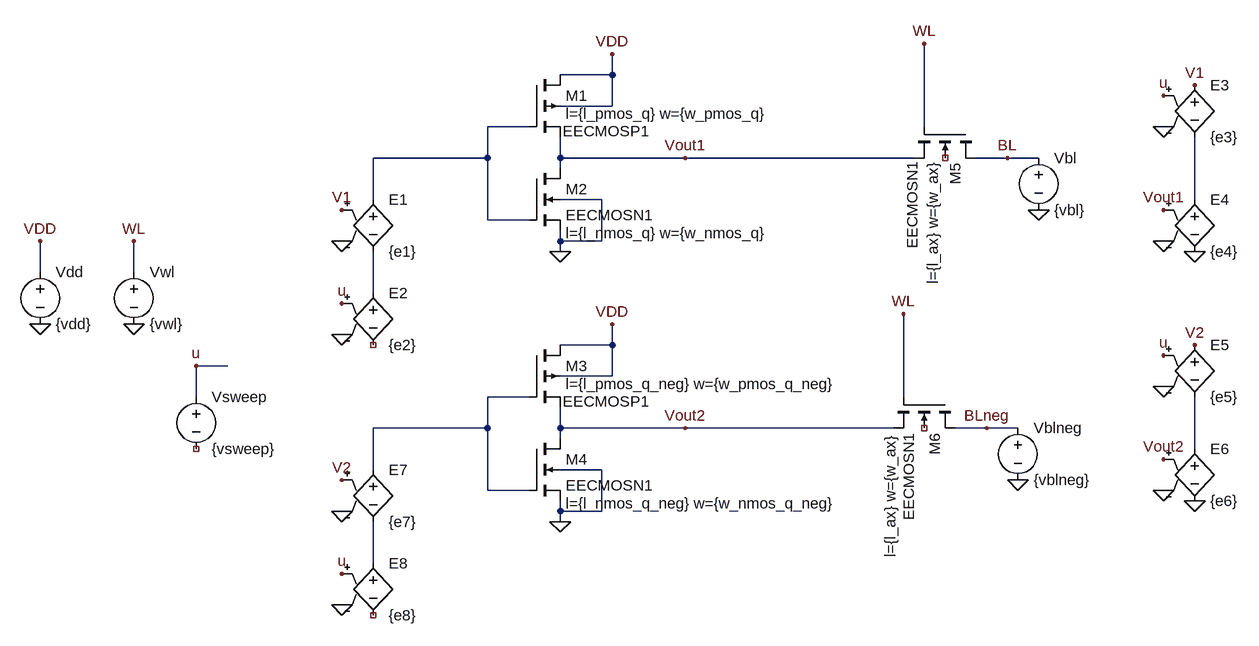
[diagram p0: schematic gaussian_vth_hold.asc]
gaussian_vth_hold.asc, the LTspice schematic file:
Version 4
SHEET 1 2120 768
WIRE 576 -160 576 -192
WIRE 576 -160 496 -160
WIRE 576 -112 576 -160
WIRE 576 -112 496 -112
WIRE 448 -80 384 -80
WIRE 1056 -80 1056 -208
WIRE 384 -32 384 -80
WIRE 384 -32 208 -32
WIRE 496 -32 496 -64
WIRE 688 -32 496 -32
WIRE 1040 -32 688 -32
WIRE 1184 -32 1136 -32
WIRE 1232 -32 1184 -32
WIRE 496 -16 496 -32
WIRE 208 32 208 -32
WIRE 560 32 496 32
WIRE 1472 32 1472 -64
WIRE 384 64 384 -32
WIRE 448 64 384 64
WIRE 496 96 496 80
WIRE 560 96 560 32
WIRE 560 96 496 96
WIRE 496 112 496 96
WIRE -304 144 -304 96
WIRE -160 144 -160 96
WIRE 208 176 208 112
WIRE 576 256 576 224
WIRE 576 256 496 256
WIRE -16 288 -64 288
WIRE 576 304 576 256
WIRE 576 304 496 304
WIRE -64 336 -64 288
WIRE 448 336 384 336
WIRE 1024 336 1024 208
WIRE 384 384 384 336
WIRE 384 384 208 384
WIRE 496 384 496 352
WIRE 688 384 496 384
WIRE 1008 384 688 384
WIRE 1152 384 1104 384
WIRE 1200 384 1152 384
WIRE 496 400 496 384
WIRE 1472 416 1472 336
WIRE 208 448 208 384
WIRE 560 448 496 448
WIRE 384 480 384 384
WIRE 448 480 384 480
WIRE 496 512 496 496
WIRE 560 512 560 448
WIRE 560 512 496 512
WIRE 496 528 496 512
WIRE 208 592 208 528
FLAG -64 288 u
FLAG 160 96 0
FLAG 160 240 0
FLAG 160 192 u
FLAG 160 48 V1
FLAG 496 112 0
FLAG 688 -32 Vout1
FLAG 1472 112 0
FLAG 1424 96 0
FLAG 1424 -80 0
FLAG 1424 -128 u
FLAG 1424 48 Vout1
FLAG 1472 -144 V1
FLAG 1424 320 0
FLAG 1472 496 0
FLAG 1424 480 0
FLAG 1424 272 u
FLAG 1472 256 V2
FLAG 1424 432 Vout2
FLAG 160 512 0
FLAG 160 656 0
FLAG 160 608 u
FLAG 160 464 V2
FLAG 496 528 0
FLAG -304 224 0
FLAG 688 384 Vout2
FLAG 1184 -32 BL
FLAG 1152 384 BLneg
FLAG -160 224 0
FLAG 1232 48 0
FLAG 1200 464 0
FLAG -304 96 VDD
FLAG 576 -192 VDD
FLAG 576 224 VDD
FLAG 1056 -208 WL
FLAG -160 96 WL
FLAG 1024 208 WL
SYMBOL voltage -64 320 R0
WINDOW 123 0 0 Left 0
WINDOW 39 0 0 Left 0
SYMATTR InstName Vsweep
SYMATTR Value {vsweep}
SYMBOL e 208 16 R0
SYMATTR InstName E1
SYMATTR Value {e1}
SYMBOL e 208 160 R0
SYMATTR InstName E2
SYMATTR Value {e2}
SYMBOL pmos4 448 -160 R0
WINDOW 3 52 87 Left 2
WINDOW 123 56 60 Left 2
SYMATTR Value EECMOSP1
SYMATTR Value2 l={l_pmos_q} w={w_pmos_q}
SYMATTR InstName M1
SYMBOL nmos4 448 -16 R0
WINDOW 123 56 100 Left 2
SYMATTR Value2 l={l_nmos_q} w={w_nmos_q}
SYMATTR InstName M2
SYMATTR Value EECMOSN1
SYMBOL e 1472 -160 R0
SYMATTR InstName E3
SYMATTR Value {e3}
SYMBOL e 1472 16 R0
SYMATTR InstName E4
SYMATTR Value {e4}
SYMBOL e 1472 240 R0
SYMATTR InstName E5
SYMATTR Value {e5}
SYMBOL e 1472 400 R0
SYMATTR InstName E6
SYMATTR Value {e6}
SYMBOL e 208 432 R0
SYMATTR InstName E7
SYMATTR Value {e7}
SYMBOL e 208 576 R0
SYMATTR InstName E8
SYMATTR Value {e8}
SYMBOL pmos4 448 256 R0
WINDOW 3 52 87 Left 2
WINDOW 123 56 60 Left 2
SYMATTR Value EECMOSP1
SYMATTR Value2 l={l_pmos_q_neg} w={w_pmos_q_neg}
SYMATTR InstName M3
SYMBOL nmos4 448 400 R0
WINDOW 123 56 100 Left 2
SYMATTR Value2 l={l_nmos_q_neg} w={w_nmos_q_neg}
SYMATTR InstName M4
SYMATTR Value EECMOSN1
SYMBOL voltage -304 128 R0
WINDOW 123 0 0 Left 0
WINDOW 39 0 0 Left 0
SYMATTR InstName Vdd
SYMATTR Value {vdd}
SYMBOL nmos4 1136 -80 R90
WINDOW 123 51 67 Left 2
WINDOW 3 54 98 Left 2
SYMATTR Value2 l={l_ax} w={w_ax}
SYMATTR Value EECMOSN1
SYMATTR InstName M5
SYMBOL voltage -160 128 R0
SYMATTR InstName Vwl
SYMATTR Value {vwl}
SYMBOL voltage 1232 -48 R0
WINDOW 123 0 0 Left 0
WINDOW 39 0 0 Left 0
SYMATTR InstName Vbl
SYMATTR Value {vbl}
SYMBOL nmos4 1104 336 R90
WINDOW 123 56 100 Left 2
SYMATTR Value2 l={l_ax} w={w_ax}
SYMATTR InstName M6
SYMATTR Value EECMOSN1
SYMBOL voltage 1200 368 R0
WINDOW 123 0 0 Left 0
WINDOW 39 0 0 Left 0
SYMATTR InstName Vblneg
SYMATTR Value {vblneg}

The netlist it stands for:
* gaussian_vth_hold.asc
Vsweep u NC_01 {vsweep}
E1 N001 N003 V1 0 {e1}
E2 N003 NC_02 u 0 {e2}
M1 VDD N001 Vout1 VDD EECMOSP1 l={l_pmos_q} w={w_pmos_q}
M2 Vout1 N001 0 0 EECMOSN1 l={l_nmos_q} w={w_nmos_q}
E3 V1 N002 u 0 {e3}
E4 N002 0 Vout1 0 {e4}
E5 V2 N005 u 0 {e5}
E6 N005 0 Vout2 0 {e6}
E7 N004 N006 V2 0 {e7}
E8 N006 NC_03 u 0 {e8}
M3 VDD N004 Vout2 VDD EECMOSP1 l={l_pmos_q_neg} w={w_pmos_q_neg}
M4 Vout2 N004 0 0 EECMOSN1 l={l_nmos_q_neg} w={w_nmos_q_neg}
Vdd VDD 0 {vdd}
M5 BL WL Vout1 NC_04 EECMOSN1 l={l_ax} w={w_ax}
Vwl WL 0 {vwl}
Vbl BL 0 {vbl}
M6 BLneg WL Vout2 NC_05 EECMOSN1 l={l_ax} w={w_ax}
Vblneg BLneg 0 {vblneg}
.model NMOS NMOS
.model PMOS PMOS
.lib standard.mos
.backanno
.end